# Altium schematic sheet USB.SchDoc: F2837x controlCARD
size 431 x 279 mm; Organization: Texas Instruments; Revision: 1.3
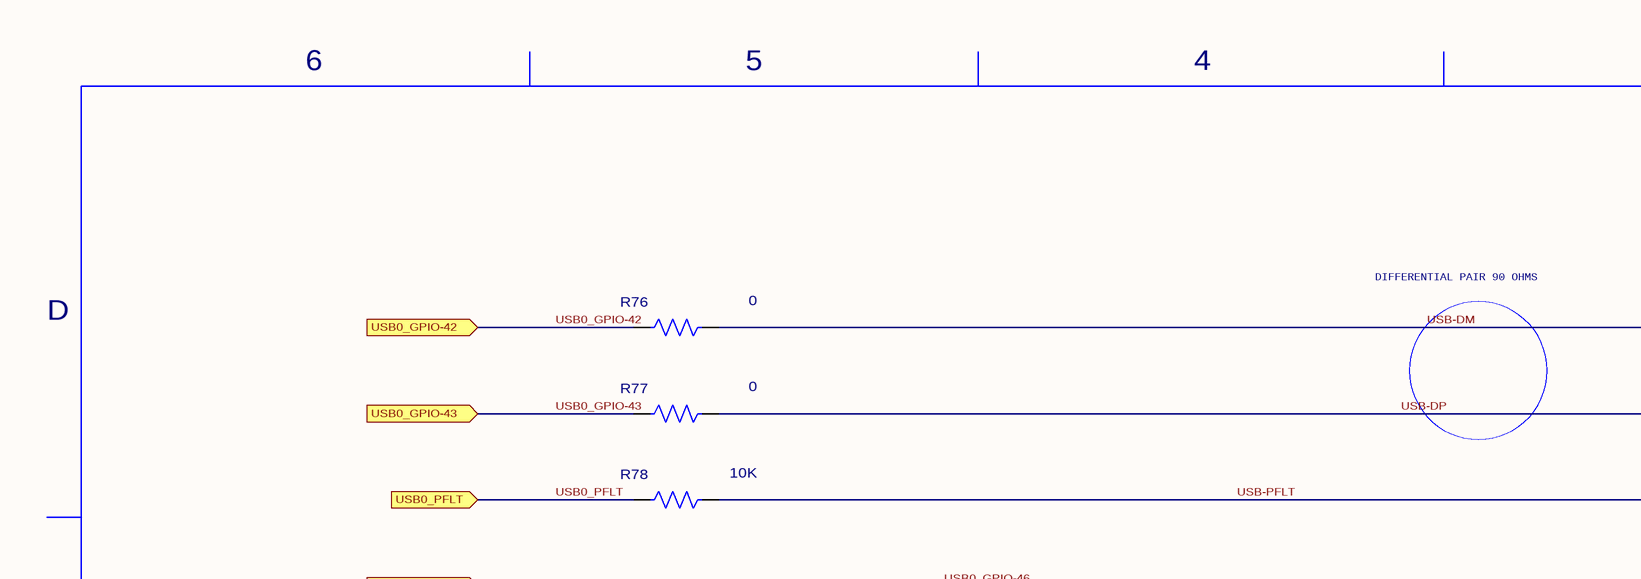
[diagram p0: USB.SchDoc, top left]
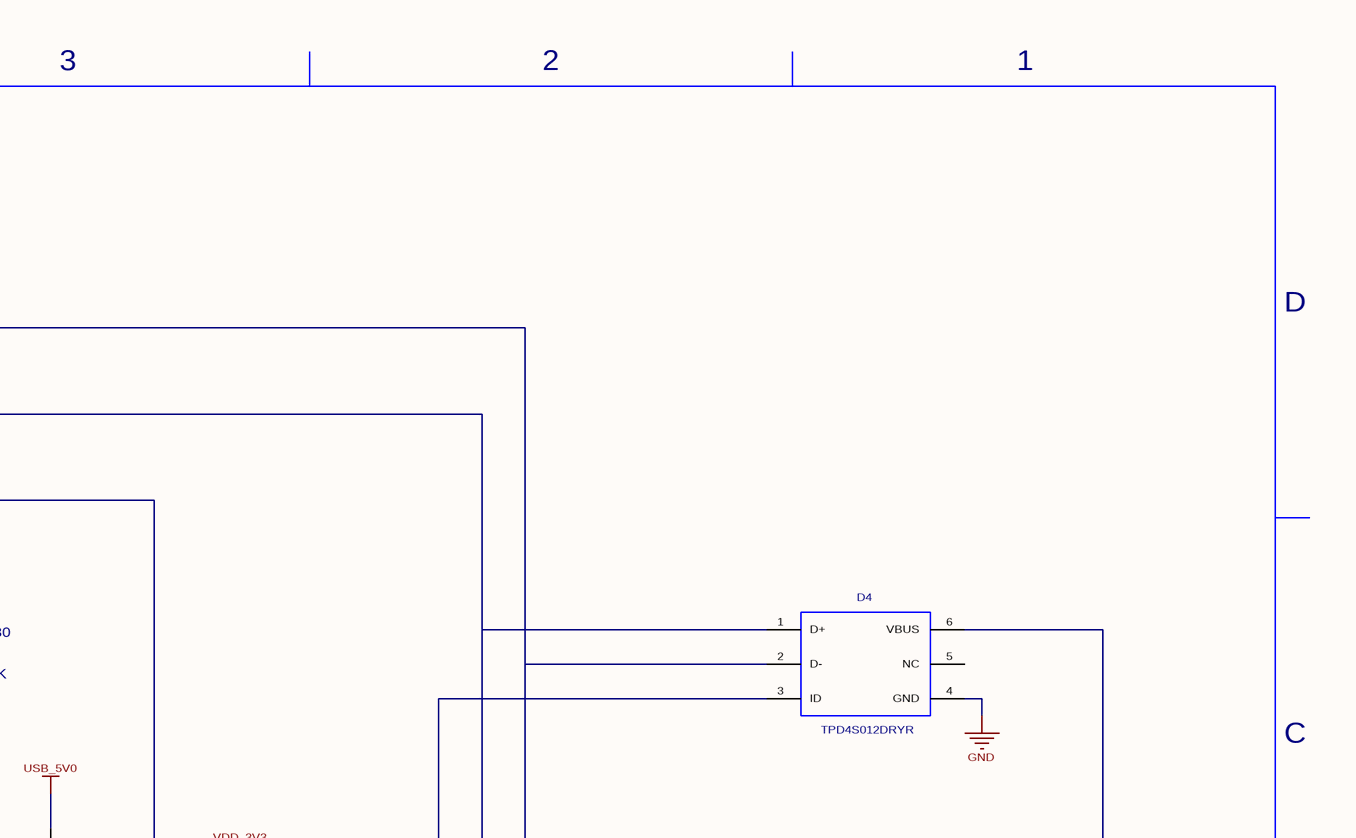
[diagram p1: USB.SchDoc, top right]
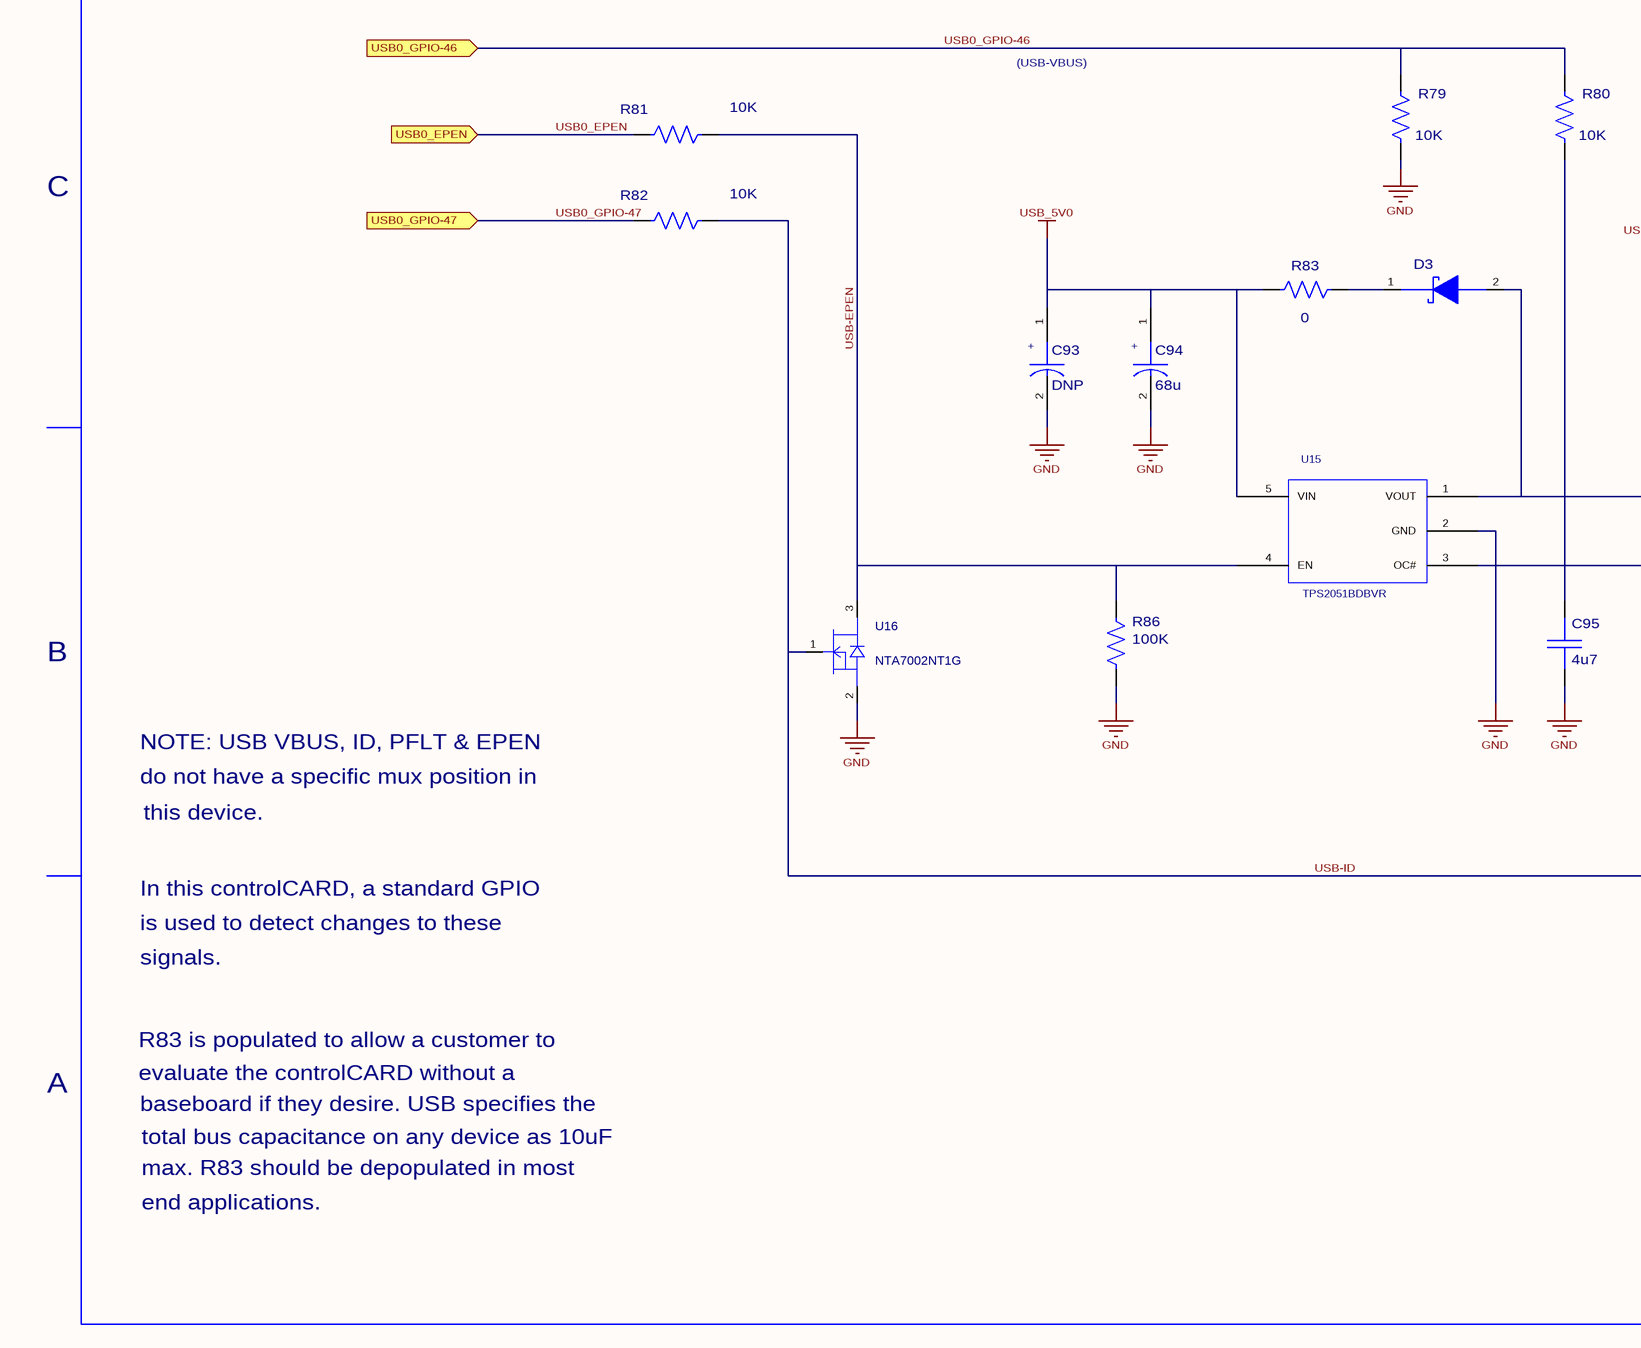
[diagram p2: USB.SchDoc, bottom left]
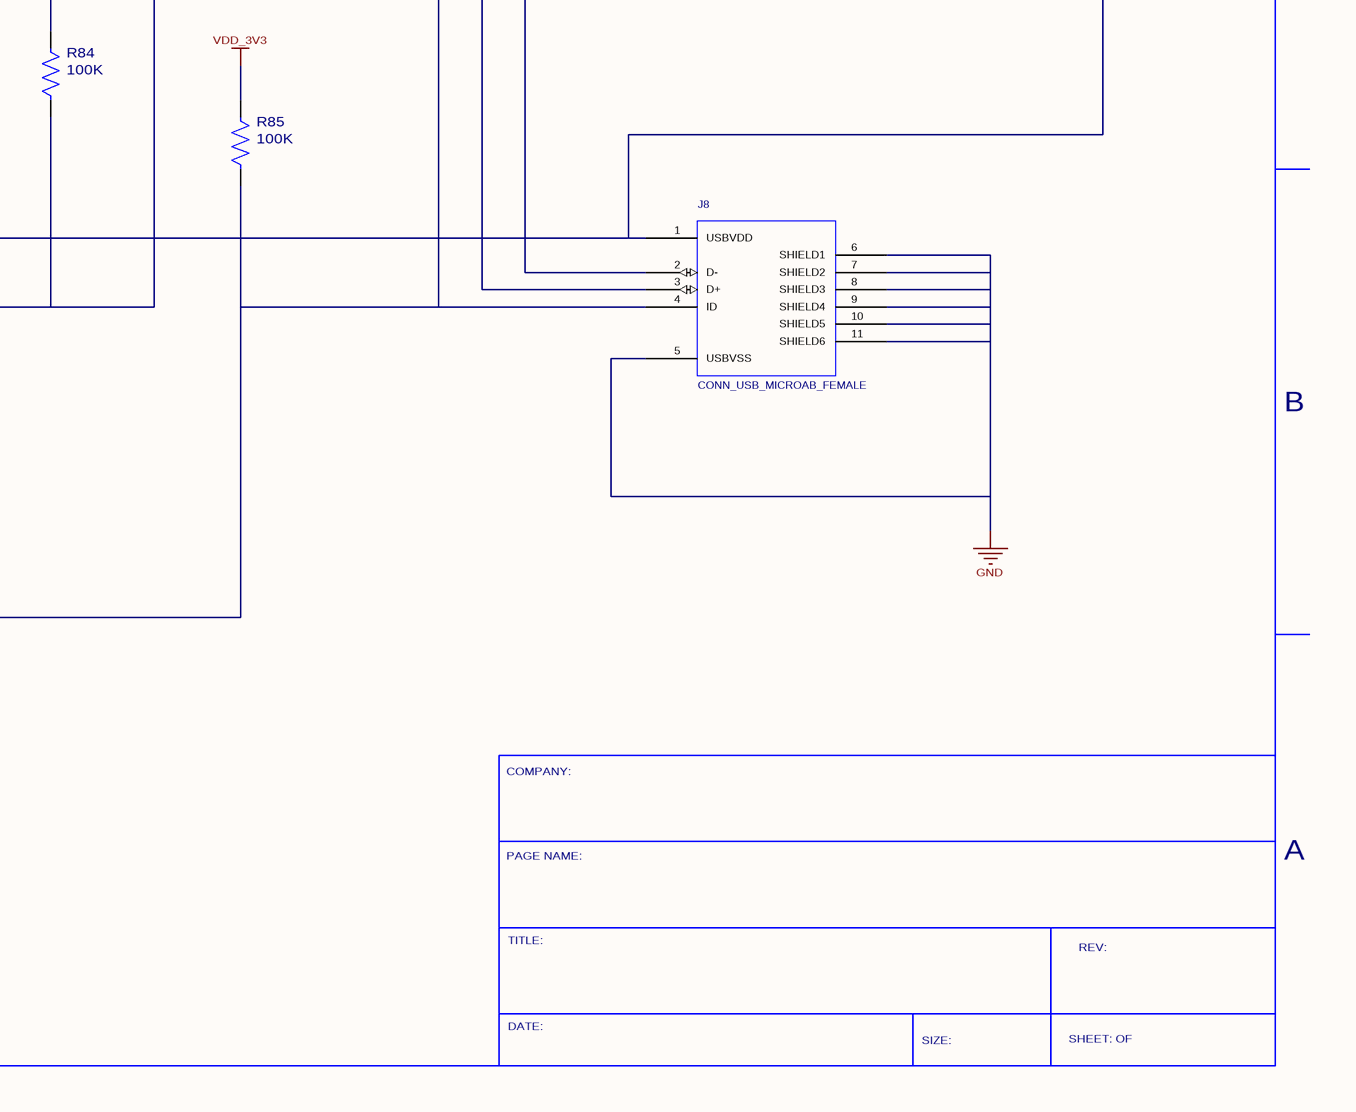
[diagram p3: USB.SchDoc, bottom right]

## Parts
C93  value DNP  [C1206P]  (hidden comment: C1206_10V_TANT)
C94  value 68u  [C1206P]  (hidden comment: C1206_10V_TANT)
C95  value 4u7  [C0603]  (hidden comment: C0603_16V_X7R)
D3  DIODE_SCHOTTKY_MBRM110ET1G  [DO-216AA]  (value not drawn)
D4  Part Number: TPD4S012DRYR  [TI_DRY_6_(R-PUSON-N6)]  (hidden comment: DIODE_USBOTG_TPD4S012DRY)
J8  CONN_USB_MICROAB_FEMALE  [CONN_USB_MICROAB_FEMALE]
R76  value 0  [R0402]  (hidden comment: R0402_5%)
R77  value 0  [R0402]  (hidden comment: R0402_5%)
R78  value 10K  [R0402]  (hidden comment: R0402_5%)
R79  value 10K  [R0402]  (hidden comment: R0402_5%)
R80  value 10K  [R0402]  (hidden comment: R0402_5%)
R81  value 10K  [R0402]  (hidden comment: R0402_5%)
R82  value 10K  [R0402]  (hidden comment: R0402_5%)
R83  value 0  [R0603]  (hidden comment: R0603_5%)
R84  value 100K  [R0603]  (hidden comment: R0603_5%)
R85  value 100K  [R0603]  (hidden comment: R0603_5%)
R86  value 100K  [R0603]  (hidden comment: R0603_5%)
U15  value TPS2051BDBVR  [SOT-23-5]  (hidden comment: IC_TPS2051BDBVR)
U16  value NTA7002NT1G  [SC-75]  (hidden comment: MOSFET_30V_0.154A_NTA7002NT1G)

## Ports
USB0_EPEN, USB0_GPIO-42, USB0_GPIO-43, USB0_GPIO-46, USB0_GPIO-47, USB0_PFLT

## Nets
GND: C93.2 C94.2 C95.1 D4.4(GND) J8.5(USBVSS) J8.6(SHIELD1) J8.7(SHIELD2) J8.8(SHIELD3) J8.9(SHIELD4) J8.10(SHIELD5) J8.11(SHIELD6) R79.2 R86.2 U15.2(GND) U16.2(D)
USB_5V0: C93.1 C94.1 R83.1 R84.1 U15.5(VIN)
VDD_3V3: R85.1
USB0_EPEN: R81.1 ; port USB0_EPEN
USB0_GPIO-42: R76.1 ; port USB0_GPIO-42
USB0_GPIO-43: R77.1 ; port USB0_GPIO-43
USB0_GPIO-46: R79.1 R80.1 ; port USB0_GPIO-46
USB0_GPIO-47: R82.1 ; port USB0_GPIO-47
USB0_PFLT: R78.1 ; port USB0_PFLT
USB-DM: D4.2(D-) J8.2(D-) R76.2
USB-DP: D4.1(D+) J8.3(D+) R77.2
USB-EPEN: R81.2 R86.1 U15.4(EN) U16.3(S)
USB-ID: D4.3(ID) J8.4(ID) R82.2 R85.2 U16.1(G)
USB-PFLT: R78.2 R84.2 U15.3(OC#)
NetC95_2: C95.2 D3.2(A) D4.6(VBUS) J8.1(USBVDD) R80.2 U15.1(VOUT)
NetD3_1: D3.1(C) R83.2

Not connected (* = marked no-connect by the designer): D4 5(NC)

## Notes on the sheet
- 6
- 5
- 4
- 3
- 2
- 1
- DIFFERENTIAL PAIR 90 OHMS
- D
- (USB-VBUS)
- C
- B
- NOTE: USB VBUS, ID, PFLT & EPEN
- do not have a specific mux position in
- In this controlCARD, a standard GPIO
- this device.
- is used to detect changes to these
- signals.
- R83 is populated to allow a customer to
- COMPANY:
- A
- evaluate the controlCARD without a
- baseboard if they desire. USB specifies the
- total bus capacitance on any device as 10uF
- PAGE NAME:
- max. R83 should be depopulated in most
- end applications.
- TITLE:
- REV:
- DATE:
- SIZE:
- SHEET: OF
- (in symbol C1206_10V_TANT) +

## Library data of the parts
C93 = C1206_10V_TANT: CAP TANT 20% 1206; Decal: C1206P; PCB DECAL: C1206P
C94 = C1206_10V_TANT: CAP TANT 10V 20% 1206; Part Number: TLJA686M010R1500; Decal: C1206P; Digikey: 478-4925-1-ND; PCB DECAL: C1206P
C95 = C0603_16V_X7R: CAP CER 6.3V 10% X5R 0603; Decal: C0603; PCB DECAL: C0603
D3 = DIODE_SCHOTTKY_MBRM110ET1G: DIODE SCHOTTKY 10V 1A POWERMITE; Manufacturer: On Semiconductor; Decal: DO-216AA; Digikey: MBRM110ET1GOSCT-ND; Part Number: MBRM110ET1G; PCB DECAL: DO-216AA
D4 = DIODE_USBOTG_TPD4S012DRY: 4-channel USB ESD Diode for USB-HS/USB OTG; 6SON; Manufacturer: Texas Instruments; Decal: TI_DRY_6; Value: TPD4S012DRYR; Digikey: 296-24244-1-ND; PCB DECAL: TI_DRY_6_(R-PUSON-N6)
J8 = CONN_USB_MICROAB_FEMALE: USB micro AB Female USB2.0; Manufacturer: TE Connectivity; Part Number: 1981584-1; Decal: CONN_USB_MICROAB_FEMALE; Digikey: A97799CT-ND; PCB DECAL: CONN_USB_MICROAB_FEMALE
R76-R82 = R0402_5%: RES 1/16W 5% 0402 SMD; Decal: R0402; PCB DECAL: R0402
R83-R86 = R0603_5%: RES 1/10W 5% 0603 SMD; Decal: R0603; PCB DECAL: R0603
U15 = IC_TPS2051BDBVR: High-Side Power Distribution Switch; Manufacturer: Texas Instruments; Decal: SOT23-5; PCB DECAL: SOT-23-5; Digikey: 296-21265-1-ND; Mouser: 595-TPS2051BDBVR; Part Number: TPS2051BDBVR
U16 = MOSFET_30V_0.154A_NTA7002NT1G: N-channel MOSFET 30V 0.154A; Manufacturer: On Semiconductor; PCB DECAL: SC-75; Decal: SC-75; Digikey: NTA7002NT1GOSCT-ND; Part Number: NTA7002NT1G